# Altium schematic sheet Voltage_Transducer.SchDoc
size A4
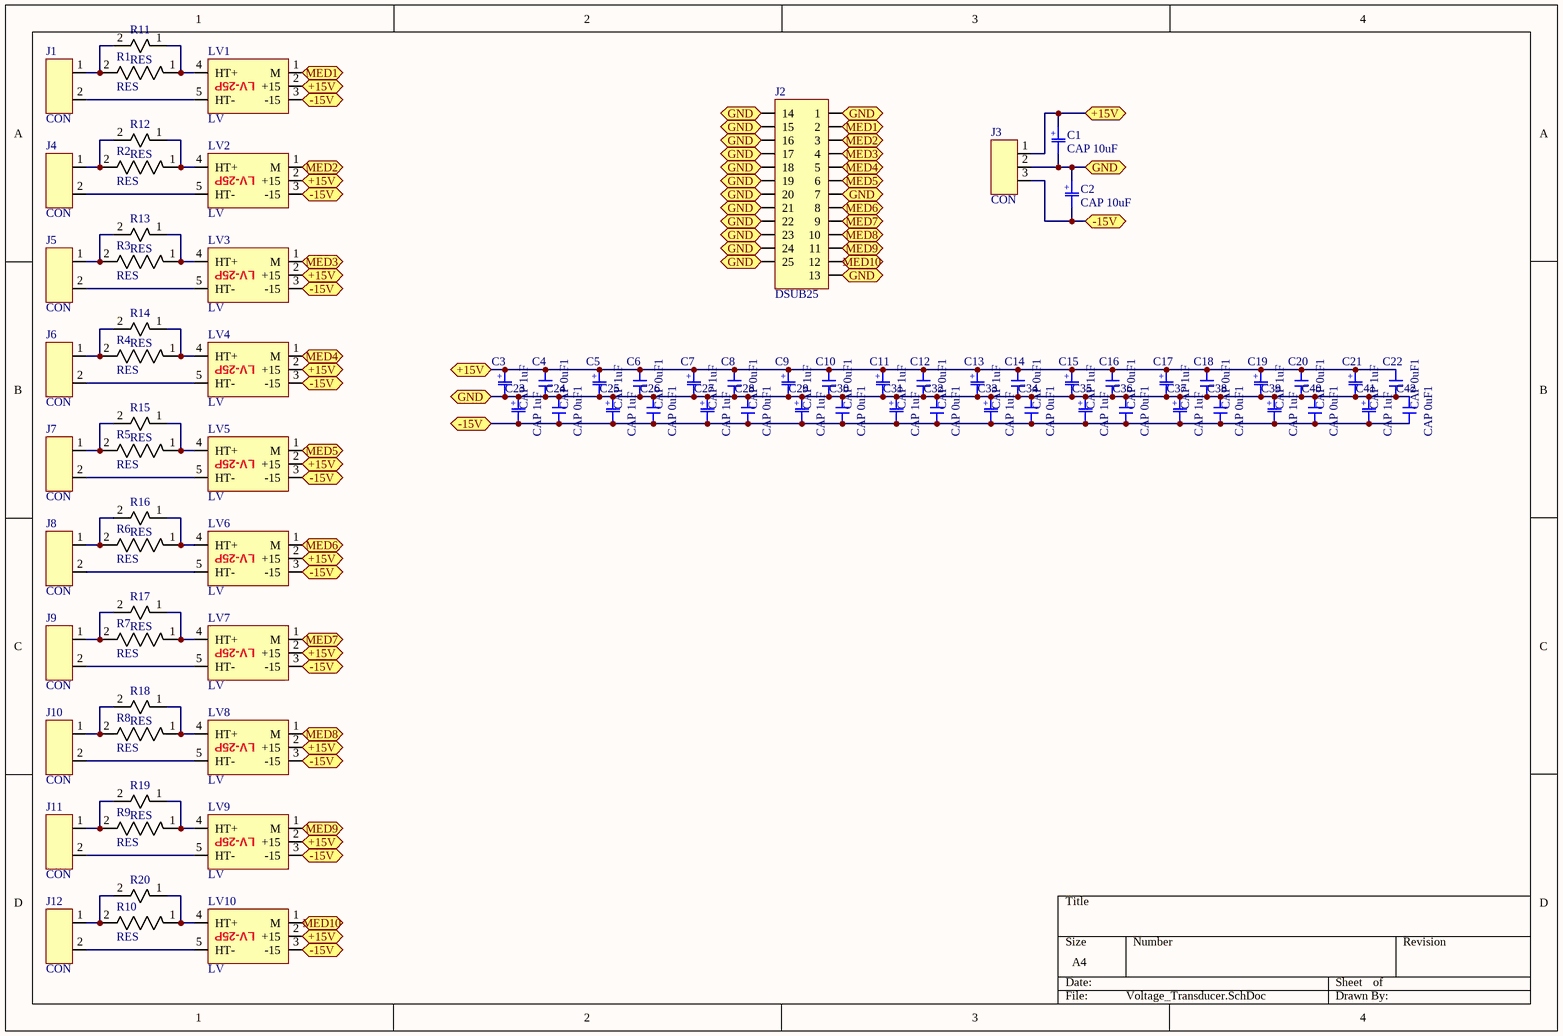
[diagram p0: Voltage_Transducer.SchDoc]

## Parts
C1  CAP 10uF  [CAPEL_1206]
C2  CAP 10uF  [CAPEL_1206]
C3  CAP 1uF  [CAPEL_1206]
C4  CAP 0uF1  [CAP_0805]
C5  CAP 1uF  [CAPEL_1206]
C6  CAP 0uF1  [CAP_0805]
C7  CAP 1uF  [CAPEL_1206]
C8  CAP 0uF1  [CAP_0805]
C9  CAP 1uF  [CAPEL_1206]
C10  CAP 0uF1  [CAP_0805]
C11  CAP 1uF  [CAPEL_1206]
C12  CAP 0uF1  [CAP_0805]
C13  CAP 1uF  [CAPEL_1206]
C14  CAP 0uF1  [CAP_0805]
C15  CAP 1uF  [CAPEL_1206]
C16  CAP 0uF1  [CAP_0805]
C17  CAP 1uF  [CAPEL_1206]
C18  CAP 0uF1  [CAP_0805]
C19  CAP 1uF  [CAPEL_1206]
C20  CAP 0uF1  [CAP_0805]
C21  CAP 1uF  [CAPEL_1206]
C22  CAP 0uF1  [CAP_0805]
C23  CAP 1uF  [CAPEL_1206]
C24  CAP 0uF1  [CAP_0805]
C25  CAP 1uF  [CAPEL_1206]
C26  CAP 0uF1  [CAP_0805]
C27  CAP 1uF  [CAPEL_1206]
C28  CAP 0uF1  [CAP_0805]
C29  CAP 1uF  [CAPEL_1206]
C30  CAP 0uF1  [CAP_0805]
C31  CAP 1uF  [CAPEL_1206]
C32  CAP 0uF1  [CAP_0805]
C33  CAP 1uF  [CAPEL_1206]
C34  CAP 0uF1  [CAP_0805]
C35  CAP 1uF  [CAPEL_1206]
C36  CAP 0uF1  [CAP_0805]
C37  CAP 1uF  [CAPEL_1206]
C38  CAP 0uF1  [CAP_0805]
C39  CAP 1uF  [CAPEL_1206]
C40  CAP 0uF1  [CAP_0805]
C41  CAP 1uF  [CAPEL_1206]
C42  CAP 0uF1  [CAP_0805]
J1  CON  [CON_282858-2]
J2  DSUB25  [DSUB25_1734350-1]
J3  CON  [CON_ED700/3]
J4  CON  [CON_282858-2]
J5  CON  [CON_282858-2]
J6  CON  [CON_282858-2]
J7  CON  [CON_282858-2]
J8  CON  [CON_282858-2]
J9  CON  [CON_282858-2]
J10  CON  [CON_282858-2]
J11  CON  [CON_282858-2]
J12  CON  [CON_282858-2]
LV1  LV  [LEM_LV 25-P]
LV2  LV  [LEM_LV 25-P]
LV3  LV  [LEM_LV 25-P]
LV4  LV  [LEM_LV 25-P]
LV5  LV  [LEM_LV 25-P]
LV6  LV  [LEM_LV 25-P]
LV7  LV  [LEM_LV 25-P]
LV8  LV  [LEM_LV 25-P]
LV9  LV  [LEM_LV 25-P]
LV10  LV  [LEM_LV 25-P]
R1  RES  [RES_RS00515K00FE73]
R2  RES  [RES_RS00515K00FE73]
R3  RES  [RES_RS00515K00FE73]
R4  RES  [RES_RS00515K00FE73]
R5  RES  [RES_RS00515K00FE73]
R6  RES  [RES_RS00515K00FE73]
R7  RES  [RES_RS00515K00FE73]
R8  RES  [RES_RS00515K00FE73]
R9  RES  [RES_RS00515K00FE73]
R10  RES  [RES_RS00515K00FE73]
R11  RES  [RES_MP925-15.0K-1%]
R12  RES  [RES_MP925-15.0K-1%]
R13  RES  [RES_MP925-15.0K-1%]
R14  RES  [RES_MP925-15.0K-1%]
R15  RES  [RES_MP925-15.0K-1%]
R16  RES  [RES_MP925-15.0K-1%]
R17  RES  [RES_MP925-15.0K-1%]
R18  RES  [RES_MP925-15.0K-1%]
R19  RES  [RES_MP925-15.0K-1%]
R20  RES  [RES_MP925-15.0K-1%]  (value not drawn)

## Ports
+15V, -15V, GND, MED1, MED2, MED3, MED4, MED5, MED6, MED7, MED8, MED9, MED10

## Nets
+15V: C1.1(+) C3.1(+) C4.1 C5.1(+) C6.1 C7.1(+) C8.1 C9.1(+) C10.1 C11.1(+) C12.1 C13.1(+) C14.1 C15.1(+) C16.1 C17.1(+) C18.1 C19.1(+) C20.1 C21.1(+) C22.1 J3.1 LV1.2(+15) LV2.2(+15) LV3.2(+15) LV4.2(+15) LV5.2(+15) LV6.2(+15) LV7.2(+15) LV8.2(+15) LV9.2(+15) LV10.2(+15) ; port +15V
-15V: C2.2(-) C23.2(-) C24.2 C25.2(-) C26.2 C27.2(-) C28.2 C29.2(-) C30.2 C31.2(-) C32.2 C33.2(-) C34.2 C35.2(-) C36.2 C37.2(-) C38.2 C39.2(-) C40.2 C41.2(-) C42.2 J3.3 LV1.3(-15) LV2.3(-15) LV3.3(-15) LV4.3(-15) LV5.3(-15) LV6.3(-15) LV7.3(-15) LV8.3(-15) LV9.3(-15) LV10.3(-15) ; port -15V
GND: C1.2(-) C2.1(+) C3.2(-) C4.2 C5.2(-) C6.2 C7.2(-) C8.2 C9.2(-) C10.2 C11.2(-) C12.2 C13.2(-) C14.2 C15.2(-) C16.2 C17.2(-) C18.2 C19.2(-) C20.2 C21.2(-) C22.2 C23.1(+) C24.1 C25.1(+) C26.1 C27.1(+) C28.1 C29.1(+) C30.1 C31.1(+) C32.1 C33.1(+) C34.1 C35.1(+) C36.1 C37.1(+) C38.1 C39.1(+) C40.1 C41.1(+) C42.1 J2.1 J2.7 J2.13 J2.14 J2.15 J2.16 J2.17 J2.18 J2.19 J2.20 J2.21 J2.22 J2.23 J2.24 J2.25 J3.2 ; port GND
MED1: J2.2 LV1.1(M) ; port MED1
MED2: J2.3 LV2.1(M) ; port MED2
MED3: J2.4 LV3.1(M) ; port MED3
MED4: J2.5 LV4.1(M) ; port MED4
MED5: J2.6 LV5.1(M) ; port MED5
MED6: J2.8 LV6.1(M) ; port MED6
MED7: J2.9 LV7.1(M) ; port MED7
MED8: J2.10 LV8.1(M) ; port MED8
MED9: J2.11 LV9.1(M) ; port MED9
MED10: J2.12 LV10.1(M) ; port MED10
NetJ1_1: J1.1 R1.2(A) R11.2(A)
NetJ1_2: J1.2 LV1.5(HT-)
NetJ4_1: J4.1 R2.2(A) R12.2(A)
NetJ4_2: J4.2 LV2.5(HT-)
NetJ5_1: J5.1 R3.2(A) R13.2(A)
NetJ5_2: J5.2 LV3.5(HT-)
NetJ6_1: J6.1 R4.2(A) R14.2(A)
NetJ6_2: J6.2 LV4.5(HT-)
NetJ7_1: J7.1 R5.2(A) R15.2(A)
NetJ7_2: J7.2 LV5.5(HT-)
NetJ8_1: J8.1 R6.2(A) R16.2(A)
NetJ8_2: J8.2 LV6.5(HT-)
NetJ9_1: J9.1 R7.2(A) R17.2(A)
NetJ9_2: J9.2 LV7.5(HT-)
NetJ10_1: J10.1 R8.2(A) R18.2(A)
NetJ10_2: J10.2 LV8.5(HT-)
NetJ11_1: J11.1 R9.2(A) R19.2(A)
NetJ11_2: J11.2 LV9.5(HT-)
NetJ12_1: J12.1 R10.2(A) R20.2(A)
NetJ12_2: J12.2 LV10.5(HT-)
NetLV1_4: LV1.4(HT+) R1.1(C) R11.1(C)
NetLV2_4: LV2.4(HT+) R2.1(C) R12.1(C)
NetLV3_4: LV3.4(HT+) R3.1(C) R13.1(C)
NetLV4_4: LV4.4(HT+) R4.1(C) R14.1(C)
NetLV5_4: LV5.4(HT+) R5.1(C) R15.1(C)
NetLV6_4: LV6.4(HT+) R6.1(C) R16.1(C)
NetLV7_4: LV7.4(HT+) R7.1(C) R17.1(C)
NetLV8_4: LV8.4(HT+) R8.1(C) R18.1(C)
NetLV9_4: LV9.4(HT+) R9.1(C) R19.1(C)
NetLV10_4: LV10.4(HT+) R10.1(C) R20.1(C)

## Notes on the sheet
- (in symbol LEM_LV 25-P) LV-25P

## Library data of the parts
C1 C2 = CAPEL_1206: F951E106MAAAQ2
C3 C5 C7 C9 C11 C13 C15 C17 C19 C21 C23 C25 C27 C29 C31 C33 C35 C37 C39 C41 = CAPEL_1206: T491A105K025AT
C4 C6 C8 C10 C12 C14 C16 C18 C20 C22 C24 C26 C28 C30 C32 C34 C36 C38 C40 C42 = CAP_0805: C0805C104K3RACTU
J1 J4-J12 = CON_282858-2: 282858-2
J2 = DSUB25_1734350-1: 1734350-1
J3 = CON_ED700/3: ED700/3
LV1-LV10 = LEM_LV 25-P: LV 25-P
R1-R10 = RES_RS00515K00FE73: RS00515K00FE73
R11-R20 = RES_MP925-15.0K-1%: MP925-15.0K-1%